# Altium schematic sheet mpc56_can.SchDoc: CAN Transceivers
size Letter; Organization: NewAE Technology Inc.; Address1: 1083 Queen St., Suite 196; Address2: Halifax; Address3: NS; Address4: Canada B3H 0B2; SheetNumber: 1; SheetTotal: 5; SheetApproved: YES
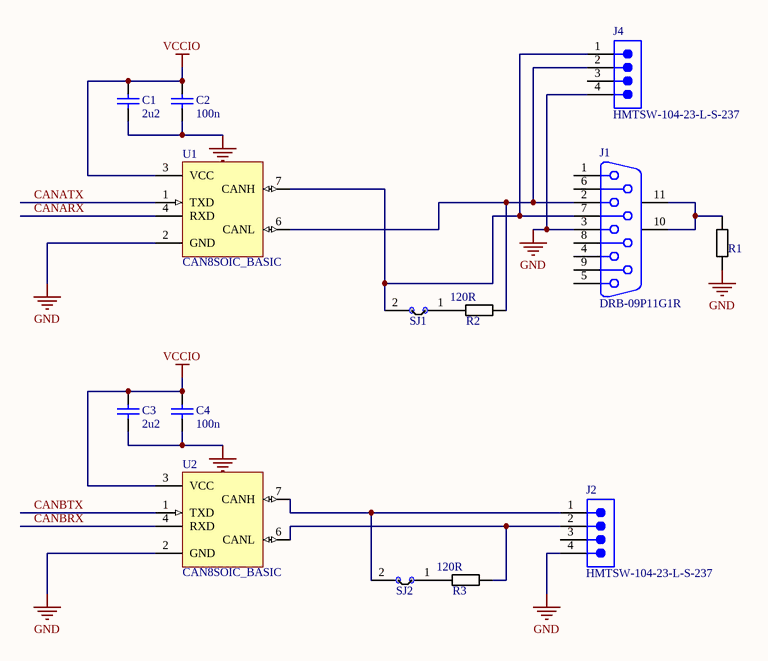
[diagram p0: mpc56_can.SchDoc]

## Parts
C1  2u2  [CAPC0603_M]
C2  100n  [CAPC0402_M]
C3  2u2  [CAPC0603_M]
C4  100n  [CAPC0402_M]
J1  DRB-09P11G1R  [TAIT-DRB-09P11G1R_V]
J2  HMTSW-104-23-L-S-237  [SMTC-HMTSW-104-23-X-S-237]
J4  HMTSW-104-23-L-S-237  [SMTC-HMTSW-104-23-X-S-237]
R1  10R  [RESC1608X55N]  (value not drawn)
R2  120R  [RESC1608X55N]
R3  120R  [RESC1608X55N]
SJ1  NC  [SJ_2S_NC]  (value not drawn)  (no BOM)
SJ2  NC  [SJ_2S_NC]  (value not drawn)  (no BOM)
U1  CAN8SOIC_BASIC  [SOIC8_NARROW]
U2  CAN8SOIC_BASIC  [SOIC8_NARROW]

## Nets
GND: C1.2 C2.2 C3.2 C4.2 J1.3 J2.4 J4.4 R1.1 U1.2(GND) U2.2(GND)
VCCIO: C1.1 C2.1 C3.1 C4.1 U1.3(VCC) U2.3(VCC)
CANARX: U1.4(RXD)
CANATX: U1.1(TXD)
CANBRX: U2.4(RXD)
CANBTX: U2.1(TXD)
NetJ1_2: J1.2 J4.2 R2.2 U1.6(CANL)
NetJ1_7: J1.7 J4.1 SJ1.2 U1.7(CANH)
NetJ1_10: J1.10(MH1) J1.11(MH2) R1.2
NetJ2_1: J2.1 SJ2.2 U2.7(CANH)
NetJ2_2: J2.2 R3.2 U2.6(CANL)
NetR2_1: R2.1 SJ1.1
NetR3_1: R3.1 SJ2.1

Not connected (* = marked no-connect by the designer): J1 1 4 5 6 8 9; J2 3; J4 3

## Notes on the sheet
- Title:
- Date:
- Rev:
- Time:
- Project:
- Sheet
- of
- License:
- Copyright © NewAE Technology Inc.
- Approved:
- NewAE.com
- File:

## Library data of the parts
C1 C3 = CCHIP-2u2-0603: 2u2, 0603; Case-EIA: 0603; Case-Metric: 1608; Part Number: CCHIP-2u2-0603; Component Kind: Standard; Component Type: Standard; Footprint: 0603; Pin Count: 2; Value: 2u2; Mounting Technology: SMT
C2 C4 = CCHIP-100n-0402: 100n, 0402; Case-EIA: 0402; Part Number: CCHIP-100n-0402; Component Kind: Standard; Component Type: Standard; Footprint: 0402; Pin Count: 2; Value: 100n; Mounting Technology: SMT
J1 = CMP-0264-00001-1: DB9 R/A Connector, Through-hole, Male; ComponentLink1URL: http://www.taitek.com/; ComponentLink2URL: http://www.taitek.com/connects_prod_info.asp?id=A100011; PartNumber: DRB-09P11G1R; PackageDescription: 9-Pin D-Sub R/A  Male Connector, 2.77 mm Pitch; ComponentLink2Description: Datasheet; Mounting Technology: Through Hole; PackageReference: DRB-09P11G1R; ComponentLink1Description: Manufacturer URL
J2 J4 = CMP-1024-00020-1: Manufacturer: Samtec; Pitch: 2.54 mm; ComponentLink3URL: http://www.samtec.com/documents/webfiles/cpdf/HMTSW-XXX-XX-X-X-XXXX-XX-XX-MKT1.pdf; PartNumber: HMTSW-104-23-L-S-237; Temperature Range: -55 to 125 degC; ComponentLink1Description: Manufacturer URL; Orientation: Vertical; ComponentLink3Description: Package Specification; ComponentLink2URL: http://www.samtec.com/documents/webfiles/pdf/HMTSW.PDF; DatasheetVersion: F-214; PackageDescription: Assembly .025 [.64] SQ. Post Hi-Temp Terminal Strip; ComponentLink1URL: http://www.samtec.com; PackageReference: HMTSW-104-23-X-S-237; RoHS: True; Mounting Technology: Through-hole; ComponentLink2Description: Datasheet; PackageVersion: AL, 3/1987
R1 = RCHIP-10R-0603: 10R res, 0603, 1%, 1/10W; Manufacture 1: Yageo; Manufacture Part Number 1: RC0603FR-0710RL; Case-EIA: 0603; Case-Metric: 1608; Rated Power: 0.1W; Rated Voltage: 75VDC; Part Number: RCHIP-10R-0603; Component Kind: Standard; Component Type: Standard; Footprint: 0603; Pin Count: 2; Supplier 1: Digi-Key; Supplier Part Number 1: 311-10.0HRCT-ND; Value: 10R; Tolerance: 1%; Mounting Technology: SMT; Temperature Range: -55C to 155C
R2 R3 = RCHIP-120R-0603: 120R res, 0603, 1%, 1/10W; Manufacture 1: Yageo; Manufacture Part Number 1: RC0603FR-07120RL; Case-EIA: 0603; Case-Metric: 1608; Rated Power: 0.1W; Rated Voltage: 75VDC; Part Number: RCHIP-120R-0603; Component Kind: Standard; Component Type: Standard; Footprint: 0603; Pin Count: 2; Supplier 1: Digi-Key; Supplier Part Number 1: 311-120HRCT-ND; Value: 120R; Tolerance: 1%; Mounting Technology: SMT; Temperature Range: -55C to 155C
SJ1 SJ2 = SJ_2S: Solder Jumper, NC; Part Number: SJ_2S; Component Type: Standard (No BOM); Pin Count: 2
U1 U2 = SN65HVD232DR: CAN Transceiver, 3.3V; Manufacture 1: Texas Instruments; Component Group: Digital IC; Part Number: SN65HVD232DR; Footprint: SOIC8; Manufacture Part Number 1: SN65HVD232DR; Pin Count: 8; Supplier 1: Digi-Key; Supplier Part Number 1: 296-26344-1-ND; Mounting Technology: SMT; RoHS: Yes; Component Kind: Standard; Component Type: Standard